# Altium schematic sheet Sheet_rectifier_updated.SchDoc
size A; SheetNumber: 1; SheetTotal: 1
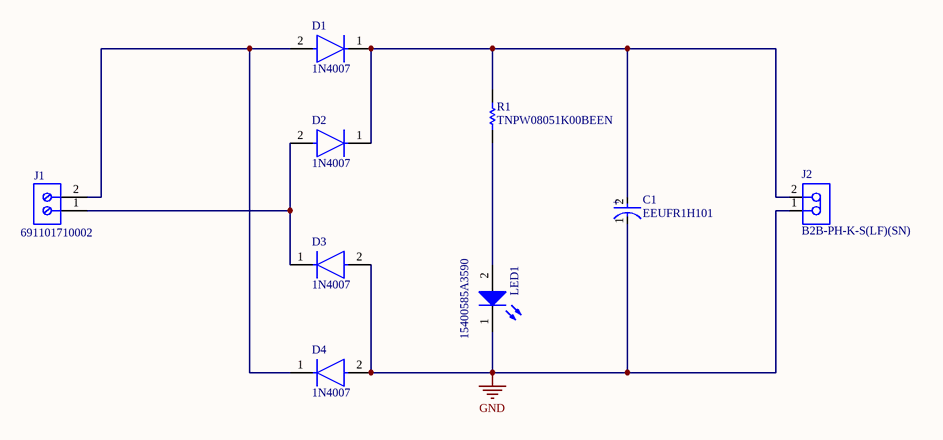
[diagram p0: Sheet_rectifier_updated.SchDoc]

## Parts
C1  EEUFR1H101  [FP-RAD-TH-D_8_0_5-L_11_5-MFG]
D1  1N4007  [FP-1N4007-MFG]
D2  1N4007  [FP-1N4007-MFG]
D3  1N4007  [FP-1N4007-MFG]
D4  1N4007  [FP-1N4007-MFG]
J1  691101710002  [691101710002]
J2  B2B-PH-K-S(LF)(SN)  [JST-B2B-PH-K-S_V]
LED1  15400585A3590  [WL-TIRW_D5.8H8.6]
R1  TNPW08051K00BEEN  [RESC2013X55X40LL15T20]

## Nets
GND: C1.1(C) D3.2(A) D4.2(A) J2.1 LED1.1(K)
NetC1_2: C1.2(A) D1.1(C) D2.1(C) J2.2 R1.2
NetD1_2: D1.2(A) D4.1(C) J1.2
NetD2_2: D2.2(A) D3.1(C) J1.1
NetLED1_2: LED1.2(A) R1.1

## Notes on the sheet
- (in symbol CMP-05427-002079-1) +

## Library data of the parts
C1 = CMP-05427-002079-1: Aluminum Electrolytic Capacitors (Radial Lead Type) 100uF ±20% 50V; ESR (Equivalent Series Resistance): 61mR; Lead Diameter: 0.6mm; Ripple Current (AC): 870mA; Life (Hours): 6000Hour; Lead/Base Style: Straight; Height - Seated (Max): 0.512inch; Height: 11.5mm; REACH SVHC: No SVHC; Contact Plating: Tin; Impedance: 61mR; Capacitance: 100uF; Voltage: 50V; Termination: Radial; Series: FR; Voltage Rating: 50V; Lead Pitch: 3.5mm; Diameter: 8mm; Number of Pins: 2; Min Operating Temperature: -40°C; Mount: Through Hole; Ripple Current: 870mA; Radiation Hardening: No; Length: 11.5mm; Max Operating Temperature: 105°C; Construction: RADIAL; Packaging: Bulk; Package Quantity: 200; Case/Package: Radial; RoHS Compliant: Yes; Voltage Rating (DC): 50V; Tolerance: 20%
D1-D4 = CMP-123542-000001-1: Rectifier diode 1000 V 1 A DO-41, ,; Manufacturer: Diotec; Max Surge Forward Current: 27A; Forward Current: 1A; Max Junction Temp: +175°C; Reverse Voltage: 1000V; Value: 15pF; Peak Reverse Current: 5uA; Category: Diode; Temperature Range Low: -50°C; Automotive: No; Temperature: -50°C to +175°C; Lead Free: Yes; ComponentLink2Description: Datasheet; Max Repetitive Reverse Voltage: 1000V; ComponentLink2URL: https://datasheet.octopart.com/1N4007-Diotec-datasheet-62346875.pdf; Manufacturer Part Number: 1N4007; Device Class L3: Rectifier Diodes; Height: 2.8mm; Octopart: https://octopart.com/1n4007-diotec-4040411; Package: 1N4007; Temperature Range High: +175°C; Device Class L1: Discrete Semiconductors; Device Class L2: Diodes; RoHS: TRUE; Capacitance: 15pF; Ipc Land Pattern Name: DIOAD888W100L520D280
J1 = CMP-1502-03256-3: Conn Terminal Block 2 POS 5mm Solder ST Thru-Hole 16A Box; Voltage Rating: 250V; Plating: Steel; Wire/Cable Gauge: 26AWG; Number of Contacts: 2; Wire Gauge (Min): 14AWG; Stripping Length: -7mm; Pitch: 5.0038mm; Number of Levels: 1; Width: 11.2mm; Color: Blue; Contact Plating: Tin; Number of Rows: 1; Voltage: 250V; Termination: Screw; Current: 16A; Lead Pitch: 5mm; RoHS: Compliant; Height: 12.8mm; Number of Positions Per Level: 2; Wire Gauge (Max): 26AWG; Contact Material: Brass; Number of Pins: 2; Housing Material: Nylon; Max Operating Temperature: 105°C; Min Operating Temperature: -40°C; Packaging: Box; Current Rating: 16A; Length: 9mm; Mount: Through Hole
J2 = CMP-2000-05162-1: Male Header, Pitch 2 mm, 1 x 2 Position, Height 6 mm, Tail Length 3.4 mm, -25 to 85 degC, RoHS, Bulk; Manufacturer: JST; Pitch: 2mm; Style/Orientation: StraightHeader/Plug; No of Positions: 2; Datasheet Version: Nov-08; Datasheet URL: http://datasheet.octopart.com/B2B-PH-K-S%28LF%29%28SN%29-JST-datasheet-8324864.pdf; Manufacturer URL: http://www.jst.com/home2.html; Type: ShroudedHeader; Termination: Crimp
LED1 = CMP-03913-82270985-2: WL-TIRW THT Infrared Round Waterclear; Viewing Angle: 35°; Peak Wavelength: 850nm; Forward Current: 1A; Max Reverse Voltage (DC): 5V; Forward Voltage: 1.5V; Wavelength: 850nm; RoHS: Compliant; Packaging: Bulk
R1 = CMP-2001-04738-1: Manufacturer: Vishay Dale; Part Number: TNPW08051K00BEEN